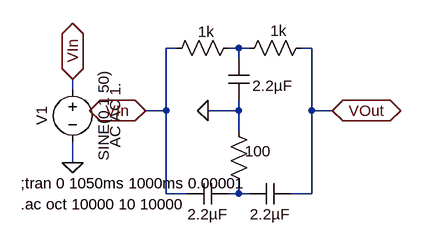
[diagram p0: schematic PhaseShiftOsc22.asc]
PhaseShiftOsc22.asc, the LTspice schematic file:
Version 4
SHEET 1 880 680
WIRE -208 160 -224 160
WIRE -112 160 -128 160
WIRE -96 160 -112 160
WIRE 0 160 -16 160
WIRE -112 176 -112 160
WIRE -368 224 -368 208
WIRE -224 256 -224 160
WIRE -224 256 -256 256
WIRE -112 256 -112 240
WIRE -112 256 -160 256
WIRE 0 256 0 160
WIRE 32 256 0 256
WIRE -112 288 -112 256
WIRE -368 336 -368 304
WIRE -224 384 -224 256
WIRE -192 384 -224 384
WIRE -112 384 -112 368
WIRE -112 384 -128 384
WIRE -96 384 -112 384
WIRE 0 384 0 256
WIRE 0 384 -32 384
FLAG -160 256 0
FLAG -368 336 0
FLAG 32 256 VOut
IOPIN 32 256 BiDir
FLAG -256 256 VIn
IOPIN -256 256 BiDir
FLAG -368 208 VIn
IOPIN -368 208 BiDir
SYMBOL res 0 144 R90
WINDOW 0 0 56 Invisible 2
WINDOW 3 -26 51 VTop 2
SYMATTR InstName R2
SYMATTR Value 1k
SYMBOL res -112 144 R90
WINDOW 0 0 56 Invisible 2
WINDOW 3 -25 50 VTop 2
SYMATTR InstName R3
SYMATTR Value 1k
SYMBOL cap -128 176 R0
WINDOW 0 24 8 Invisible 2
WINDOW 3 37 42 Left 2
SYMATTR InstName C1
SYMATTR Value 2.2µF
SYMBOL cap -32 368 R90
WINDOW 0 0 32 Invisible 2
WINDOW 3 32 32 VTop 2
SYMATTR InstName C2
SYMATTR Value 2.2µF
SYMBOL cap -128 368 R90
WINDOW 0 0 32 Invisible 2
WINDOW 3 32 32 VTop 2
SYMATTR InstName C3
SYMATTR Value 2.2µF
SYMBOL res -128 272 R0
WINDOW 0 36 40 Invisible 2
WINDOW 3 25 47 Left 2
SYMATTR InstName R4
SYMATTR Value 100
SYMBOL voltage -368 208 R0
WINDOW 0 -32 56 VBottom 2
WINDOW 3 32 56 VTop 2
WINDOW 123 50 56 VTop 2
WINDOW 39 0 0 Left 2
SYMATTR InstName V1
SYMATTR Value SINE(0 1 50)
SYMATTR Value2 AC AC 1.
TEXT -448 368 Left 2 !;tran 0 1050ms 1000ms 0.00001
TEXT -448 400 Left 2 !.ac oct 10000 10 10000

The netlist it stands for:
* PhaseShiftOsc22.asc
R2 VOut N001 1k
R3 N001 VIn 1k
C1 N001 0 2.2µF
C2 VOut N002 2.2µF
C3 N002 VIn 2.2µF
R4 0 N002 100
V1 VIn 0 SINE(0 1 50) AC AC 1.
;tran 0 1050ms 1000ms 0.00001
.ac oct 10000 10 10000
.backanno
.end